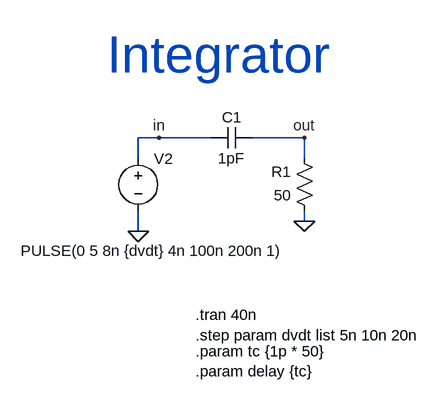
[diagram p0: schematic integrator.asc]
integrator.asc, the LTspice schematic file:
Version 4
SHEET 1 880 680
WIRE 320 240 288 240
WIRE 400 240 320 240
WIRE 544 240 464 240
WIRE 288 272 288 240
WIRE 544 272 544 240
WIRE 544 368 544 352
WIRE 288 384 288 352
FLAG 544 368 0
FLAG 288 384 0
FLAG 544 240 out
FLAG 320 240 in
SYMBOL voltage 288 256 R0
WINDOW 3 -181 158 Left 2
SYMATTR Value PULSE(0 5 8n {dvdt} 4n 100n 200n 1)
SYMATTR InstName V2
SYMBOL Res 560 368 R180
WINDOW 0 36 76 Left 2
WINDOW 3 36 40 Left 2
SYMATTR InstName R1
SYMATTR Value 50
SYMBOL Cap 464 224 R90
WINDOW 0 0 32 VBottom 2
WINDOW 3 32 32 VTop 2
SYMATTR InstName C1
SYMATTR Value 1pF
TEXT 376 512 Left 2 !.tran 40n
TEXT 376 568 Left 2 !.param tc {1p * 50}\n.param delay {tc}
TEXT 376 544 Left 2 !.step param dvdt list 5n 10n 20n
TEXT 240 112 Left 6 ;Integrator

The netlist it stands for:
* integrator.asc
V2 in 0 PULSE(0 5 8n {dvdt} 4n 100n 200n 1)
R1 0 out 50
C1 out in 1pF
.tran 40n
.param tc {1p * 50}
.param delay {tc}
.step param dvdt list 5n 10n 20n
* Integrator
.backanno
.end